# EAGLE schematic slaveV11 (EAGLE 6.3)

## Sheet 1 of 2
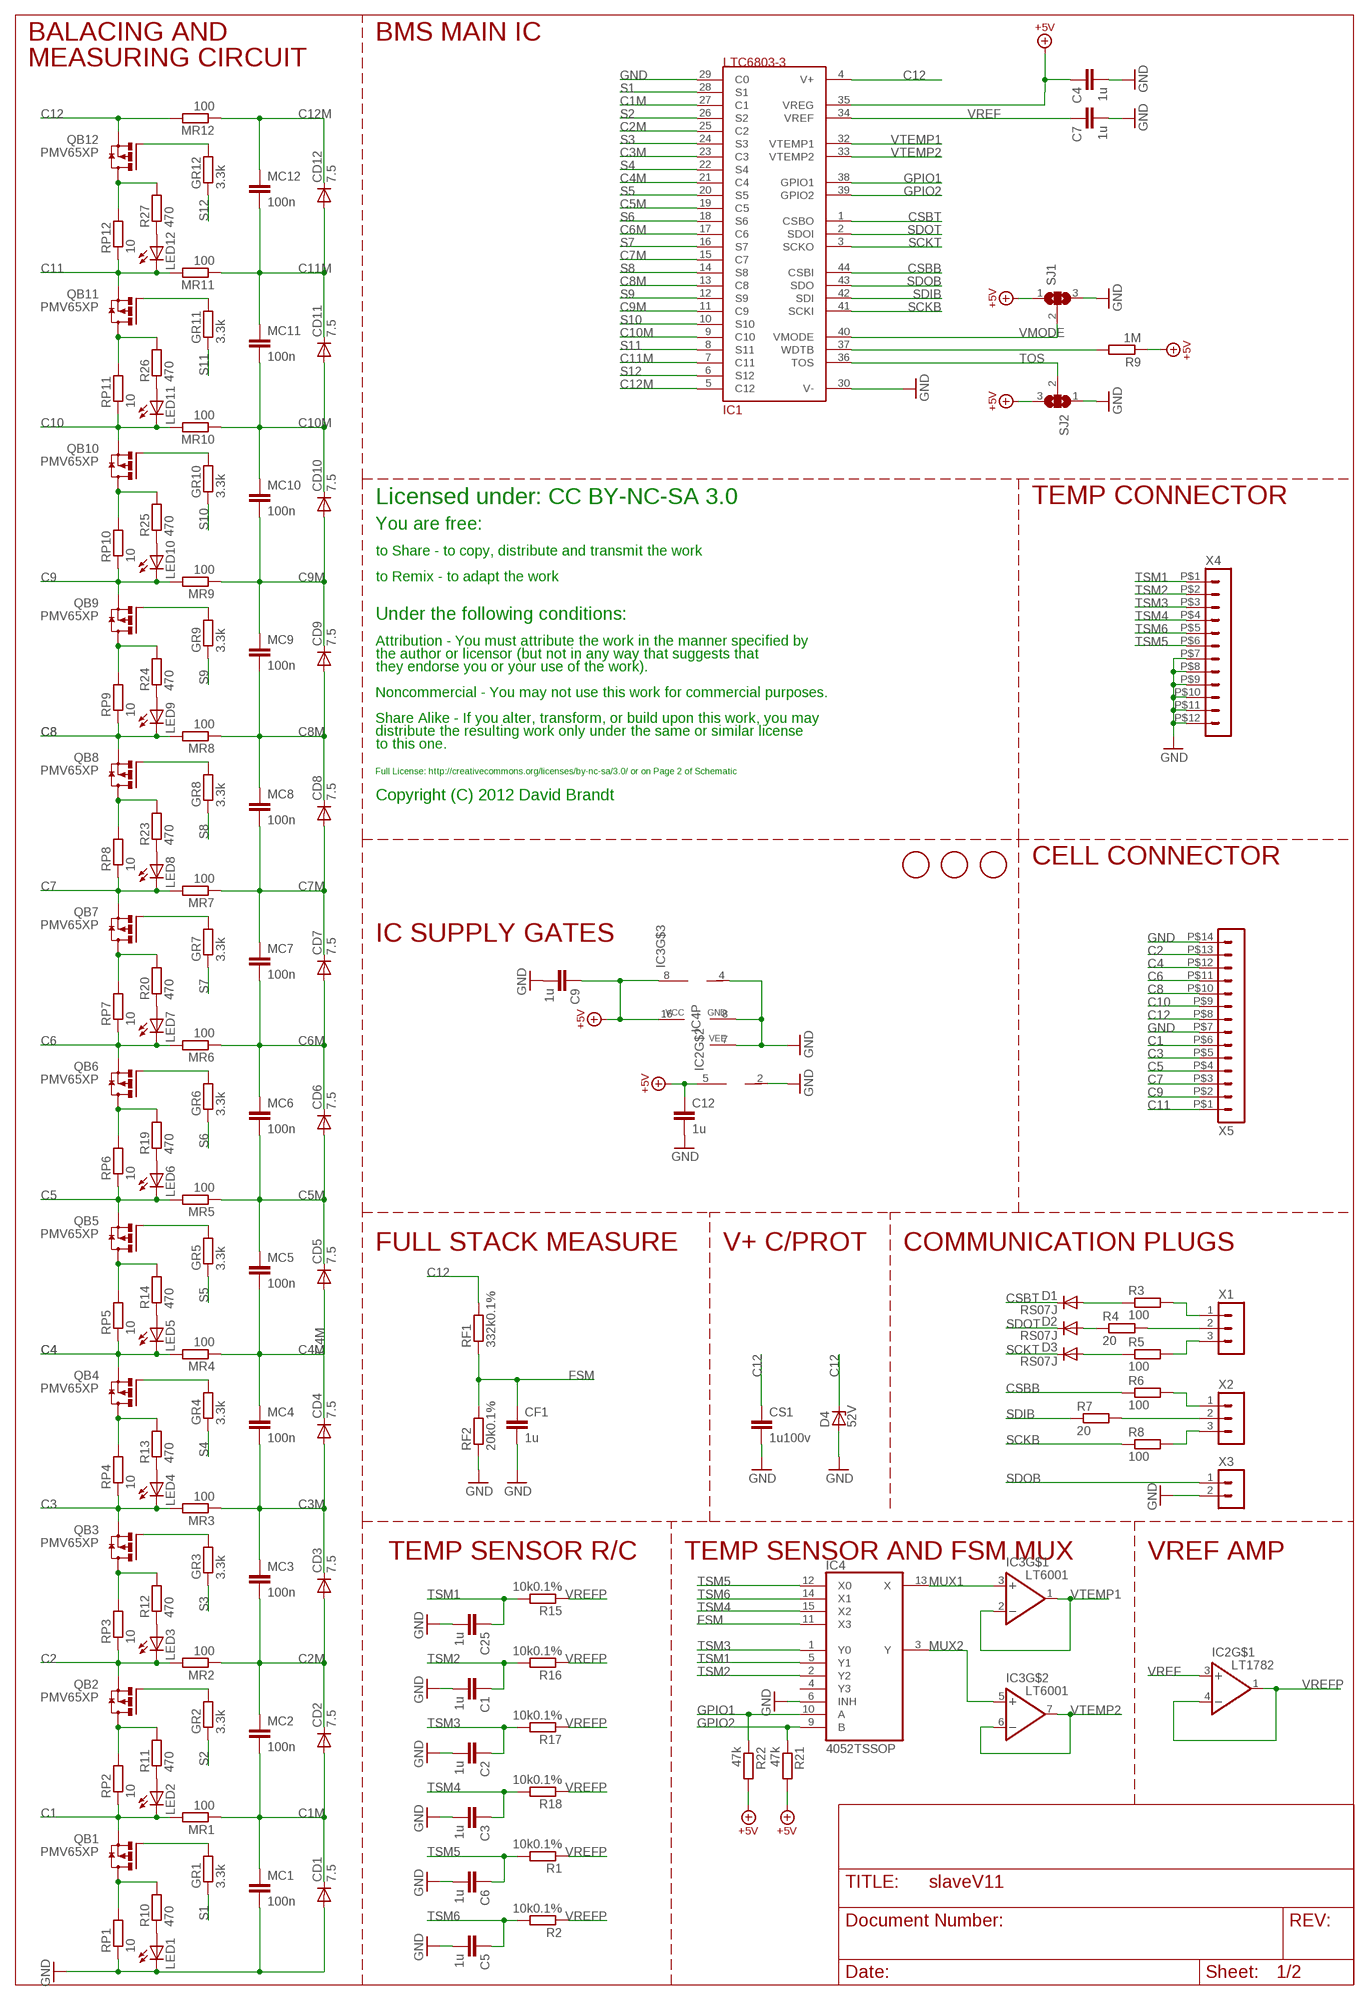
[diagram p0: schematic, sheet 1]

### Parts
C1  1u  C-EUC0603  [C0603]
C2  1u  C-EUC0603  [C0603]
C3  1u  C-EUC0603  [C0603]
C4  1u  C-EUC0603  [C0603]
C5  1u  C-EUC0603  [C0603]
C6  1u  C-EUC0603  [C0603]
C7  1u  C-EUC0603  [C0603]
C9  1u  C-EUC0603  [C0603]
C12  1u  C-EUC0603  [C0603]
C25  1u  C-EUC0603  [C0603]
CD1  7.5  DIODE-SOD323-W  [SOD323-W]
CD2  7.5  DIODE-SOD323-W  [SOD323-W]
CD3  7.5  DIODE-SOD323-W  [SOD323-W]
CD4  7.5  DIODE-SOD323-W  [SOD323-W]
CD5  7.5  DIODE-SOD323-W  [SOD323-W]
CD6  7.5  DIODE-SOD323-W  [SOD323-W]
CD7  7.5  DIODE-SOD323-W  [SOD323-W]
CD8  7.5  DIODE-SOD323-W  [SOD323-W]
CD9  7.5  DIODE-SOD323-W  [SOD323-W]
CD10  7.5  DIODE-SOD323-W  [SOD323-W]
CD11  7.5  DIODE-SOD323-W  [SOD323-W]
CD12  7.5  DIODE-SOD323-W  [SOD323-W]
CF1  1u  C-EUC0603  [C0603]
CS1  1u100v  C-EUC1206K  [C1206K]
D1  RS07J  [DO-219AB]
D2  RS07J  [DO-219AB]
D3  RS07J  [DO-219AB]
D4  52V  ZENER-DIODESOD123  [SOD123]
GR1  3.3k  R-EU_R0603  [R0603]
GR2  3.3k  R-EU_R0603  [R0603]
GR3  3.3k  R-EU_R0603  [R0603]
GR4  3.3k  R-EU_R0603  [R0603]
GR5  3.3k  R-EU_R0603  [R0603]
GR6  3.3k  R-EU_R0603  [R0603]
GR7  3.3k  R-EU_R0603  [R0603]
GR8  3.3k  R-EU_R0603  [R0603]
GR9  3.3k  R-EU_R0603  [R0603]
GR10  3.3k  R-EU_R0603  [R0603]
GR11  3.3k  R-EU_R0603  [R0603]
GR12  3.3k  R-EU_R0603  [R0603]
IC1  LTC6803-3  [44SSOP]
IC2  LT1782  [SOT23-5]
IC3  LT6001  LT6004  [MS8]
IC4  4052TSSOP  [TSSOP16]
LED1  LEDCHIPLED_0805  [CHIPLED_0805]
LED2  LEDCHIPLED_0805  [CHIPLED_0805]
LED3  LEDCHIPLED_0805  [CHIPLED_0805]
LED4  LEDCHIPLED_0805  [CHIPLED_0805]
LED5  LEDCHIPLED_0805  [CHIPLED_0805]
LED6  LEDCHIPLED_0805  [CHIPLED_0805]
LED7  LEDCHIPLED_0805  [CHIPLED_0805]
LED8  LEDCHIPLED_0805  [CHIPLED_0805]
LED9  LEDCHIPLED_0805  [CHIPLED_0805]
LED10  LEDCHIPLED_0805  [CHIPLED_0805]
LED11  LEDCHIPLED_0805  [CHIPLED_0805]
LED12  LEDCHIPLED_0805  [CHIPLED_0805]
MC1  100n  C-EUC1206  [C1206]
MC2  100n  C-EUC1206  [C1206]
MC3  100n  C-EUC1206  [C1206]
MC4  100n  C-EUC1206  [C1206]
MC5  100n  C-EUC1206  [C1206]
MC6  100n  C-EUC1206  [C1206]
MC7  100n  C-EUC1206  [C1206]
MC8  100n  C-EUC1206  [C1206]
MC9  100n  C-EUC1206  [C1206]
MC10  100n  C-EUC1206  [C1206]
MC11  100n  C-EUC1206  [C1206]
MC12  100n  C-EUC1206  [C1206]
MR1  100  R-EU_R0603  [R0603]
MR2  100  R-EU_R0603  [R0603]
MR3  100  R-EU_R0603  [R0603]
MR4  100  R-EU_R0603  [R0603]
MR5  100  R-EU_R0603  [R0603]
MR6  100  R-EU_R0603  [R0603]
MR7  100  R-EU_R0603  [R0603]
MR8  100  R-EU_R0603  [R0603]
MR9  100  R-EU_R0603  [R0603]
MR10  100  R-EU_R0603  [R0603]
MR11  100  R-EU_R0603  [R0603]
MR12  100  R-EU_R0603  [R0603]
QB1  PMV65XP  FDN360P  [SUPER-SOT3]
QB2  PMV65XP  FDN360P  [SUPER-SOT3]
QB3  PMV65XP  FDN360P  [SUPER-SOT3]
QB4  PMV65XP  FDN360P  [SUPER-SOT3]
QB5  PMV65XP  FDN360P  [SUPER-SOT3]
QB6  PMV65XP  FDN360P  [SUPER-SOT3]
QB7  PMV65XP  FDN360P  [SUPER-SOT3]
QB8  PMV65XP  FDN360P  [SUPER-SOT3]
QB9  PMV65XP  FDN360P  [SUPER-SOT3]
QB10  PMV65XP  FDN360P  [SUPER-SOT3]
QB11  PMV65XP  FDN360P  [SUPER-SOT3]
QB12  PMV65XP  FDN360P  [SUPER-SOT3]
R1  10k0.1%  R-EU_R0603  [R0603]
R2  10k0.1%  R-EU_R0603  [R0603]
R3  100  R-EU_R0805  [R0805]
R4  20  R-EU_R0805  [R0805]
R5  100  R-EU_R0805  [R0805]
R6  100  R-EU_R0805  [R0805]
R7  20  R-EU_R0805  [R0805]
R8  100  R-EU_R0805  [R0805]
R9  1M  R-EU_R0603  [R0603]
R10  470  R-EU_R0603  [R0603]
R11  470  R-EU_R0603  [R0603]
R12  470  R-EU_R0603  [R0603]
R13  470  R-EU_R0603  [R0603]
R14  470  R-EU_R0603  [R0603]
R15  10k0.1%  R-EU_R0603  [R0603]
R16  10k0.1%  R-EU_R0603  [R0603]
R17  10k0.1%  R-EU_R0603  [R0603]
R18  10k0.1%  R-EU_R0603  [R0603]
R19  470  R-EU_R0603  [R0603]
R20  470  R-EU_R0603  [R0603]
R21  47k  R-EU_R0603  [R0603]
R22  47k  R-EU_R0603  [R0603]
R23  470  R-EU_R0603  [R0603]
R24  470  R-EU_R0603  [R0603]
R25  470  R-EU_R0603  [R0603]
R26  470  R-EU_R0603  [R0603]
R27  470  R-EU_R0603  [R0603]
REF1  FIDUCIALMOUNT  [FIDUCIA-MOUNT]
REF2  FIDUCIALMOUNT  [FIDUCIA-MOUNT]
REF3  FIDUCIALMOUNT  [FIDUCIA-MOUNT]
RF1  332k0.1%  R-EU_R0603  [R0603]
RF2  20k0.1%  R-EU_R0603  [R0603]
RP1  10  R-EU_SM_3  [SM_3]
RP2  10  R-EU_SM_3  [SM_3]
RP3  10  R-EU_SM_3  [SM_3]
RP4  10  R-EU_SM_3  [SM_3]
RP5  10  R-EU_SM_3  [SM_3]
RP6  10  R-EU_SM_3  [SM_3]
RP7  10  R-EU_SM_3  [SM_3]
RP8  10  R-EU_SM_3  [SM_3]
RP9  10  R-EU_SM_3  [SM_3]
RP10  10  R-EU_SM_3  [SM_3]
RP11  10  R-EU_SM_3  [SM_3]
RP12  10  R-EU_SM_3  [SM_3]
SJ1  SJ2W  [SJ_2]
SJ2  SJ2W  [SJ_2]
X1  HEADER_POS3_43650-0315  [43650-0315]
X2  HEADER_POS3_43650-0315  [43650-0315]
X3  HEADER_POS2_43650-0215  [43650-0215]
X4  HEADER_POS12_43045-1212  [43045-1212]
X5  HEADER_POS14_43045-1412  [43045-1412]

### Nets
+5V: C4.1 C9.1 C12.1 IC1.35(VREG) IC2.5(V+) IC3.8(V+) IC4.16(VCC) R9.1 R21.2 R22.2 SJ1.1 SJ2.3 ; supply symbol labelled V+5V
B1: QB1.3(D) R10.2 RP1.P$2
B2: QB2.3(D) R11.2 RP2.P$2
B3: QB3.3(D) R12.2 RP3.P$2
B4: QB4.3(D) R13.2 RP4.P$2
B5: QB5.3(D) R14.2 RP5.P$2
B6: QB6.3(D) R19.2 RP6.P$2
B7: QB7.3(D) R20.2 RP7.P$2
B8: QB8.3(D) R23.2 RP8.P$2
B9: QB9.3(D) R24.2 RP9.P$2
B10: QB10.3(D) R25.2 RP10.P$2
B11: QB11.3(D) R26.2 RP11.P$2
B12: QB12.3(D) R27.2 RP12.P$2
C1: LED2.C MR1.2 QB1.2(S) RP2.P$1 X5.P$6
C1M: CD1.C CD2.A IC1.27(C1) MC1.1 MC2.2 MR1.1
C2: LED3.C MR2.2 QB2.2(S) RP3.P$1 X5.P$13
C2M: CD2.C CD3.A IC1.25(C2) MC2.1 MC3.2 MR2.1
C3: LED4.C MR3.2 QB3.2(S) RP4.P$1 X5.P$5
C3M: CD3.C CD4.A IC1.23(C3) MC3.1 MC4.2 MR3.1
C4: LED5.C MR4.2 QB4.2(S) RP5.P$1 X5.P$12
C4M: CD4.C CD5.A IC1.21(C4) MC4.1 MC5.2 MR4.1
C5: LED6.C MR5.2 QB5.2(S) RP6.P$1 X5.P$4
C5M: CD5.C CD6.A IC1.19(C5) MC5.1 MC6.2 MR5.1
C6: LED7.C MR6.2 QB6.2(S) RP7.P$1 X5.P$11
C6M: CD6.C CD7.A IC1.17(C6) MC6.1 MC7.2 MR6.1
C7: LED8.C MR7.2 QB7.2(S) RP8.P$1 X5.P$3
C7M: CD7.C CD8.A IC1.15(C7) MC7.1 MC8.2 MR7.1
C8: LED9.C MR8.2 QB8.2(S) RP9.P$1 X5.P$10
C8M: CD8.C CD9.A IC1.13(C8) MC8.1 MC9.2 MR8.1
C9: LED10.C MR9.2 QB9.2(S) RP10.P$1 X5.P$2
C9M: CD9.C CD10.A IC1.11(C9) MC9.1 MC10.2 MR9.1
C10: LED11.C MR10.2 QB10.2(S) RP11.P$1 X5.P$9
C10M: CD10.C CD11.A IC1.9(C10) MC10.1 MC11.2 MR10.1
C11: LED12.C MR11.2 QB11.2(S) RP12.P$1 X5.P$1
C11M: CD11.C CD12.A IC1.7(C11) MC11.1 MC12.2 MR11.1
C12: CS1.1 D4.C IC1.4(V+) MR12.2 QB12.2(S) RF1.2 X5.P$8
C12M: CD12.C IC1.5(C12) MC12.1 MR12.1
CSBB: IC1.44(CSBI) R6.1
CSBBP: R6.2 X2.1
CSBT: D1.C IC1.1(CSBO)
CSBTK: D1.A R3.1
CSBTP: R3.2 X1.1
FSM: CF1.1 IC4.11(X3) RF1.1 RF2.2
GND: C1.2 C2.2 C3.2 C4.2 C5.2 C6.2 C7.2 C9.2 C12.2 C25.2 CD1.A CF1.2 CS1.2 D4.A IC1.29(C0) IC1.30(V-) IC2.2(V-) IC3.4(V-) IC4.6(INH) IC4.7(VEE) IC4.8(GND) LED1.C MC1.2 RF2.1 RP1.P$1 SJ1.3 SJ2.1 X3.2 X4.P$7 X4.P$8 X4.P$9 X4.P$10 X4.P$11 X4.P$12 X5.P$7 X5.P$14
GPIO1: IC1.38(GPIO1) IC4.10(A) R22.1
GPIO2: IC1.39(GPIO2) IC4.9(B) R21.1
L1C: LED1.A R10.1
L2C: LED2.A R11.1
L3C: LED3.A R12.1
L4C: LED4.A R13.1
L5C: LED5.A R14.1
L6C: LED6.A R19.1
L7C: LED7.A R20.1
L8C: LED8.A R23.1
L9C: LED9.A R24.1
L10C: LED10.A R25.1
L11C: LED11.A R26.1
L12C: LED12.A R27.1
MUX1: IC3.3(+IN) IC4.13(X)
MUX2: IC3.5(+IN) IC4.3(Y)
S1: GR1.1 IC1.28(S1)
S1G: GR1.2 QB1.1(G)
S1G1: GR2.2 QB2.1(G)
S1G2: GR3.2 QB3.1(G)
S1G3: GR4.2 QB4.1(G)
S1G4: GR5.2 QB5.1(G)
S1G5: GR6.2 QB6.1(G)
S1G6: GR7.2 QB7.1(G)
S1G7: GR8.2 QB8.1(G)
S1G8: GR9.2 QB9.1(G)
S1G9: GR10.2 QB10.1(G)
S1G10: GR11.2 QB11.1(G)
S1G11: GR12.2 QB12.1(G)
S2: GR2.1 IC1.26(S2)
S3: GR3.1 IC1.24(S3)
S4: GR4.1 IC1.22(S4)
S5: GR5.1 IC1.20(S5)
S6: GR6.1 IC1.18(S6)
S7: GR7.1 IC1.16(S7)
S8: GR8.1 IC1.14(S8)
S9: GR9.1 IC1.12(S9)
S10: GR10.1 IC1.10(S10)
S11: GR11.1 IC1.8(S11)
S12: GR12.1 IC1.6(S12)
SCKB: IC1.41(SCKI) R8.1
SCKBP: R8.2 X2.3
SCKT: D3.C IC1.3(SCKO)
SCKTK: D3.A R5.1
SCKTP: R5.2 X1.3
SDIB: IC1.42(SDI) R7.1
SDIBP: R7.2 X2.2
SDOB: IC1.43(SDO) X3.1
SDOT: D2.C IC1.2(SDOI)
SDOTK: D2.A R4.1
SDOTP: R4.2 X1.2
TOS: IC1.36(TOS) SJ2.2
TSM1: C25.1 IC4.5(Y1) R15.2 X4.P$1
TSM2: C1.1 IC4.2(Y2) R16.2 X4.P$2
TSM3: C2.1 IC4.1(Y0) R17.2 X4.P$3
TSM4: C3.1 IC4.15(X2) R18.2 X4.P$4
TSM5: C6.1 IC4.12(X0) R1.2 X4.P$6
TSM6: C5.1 IC4.14(X1) R2.2 X4.P$5
VMODE: IC1.40(VMODE) SJ1.2
VREF: C7.1 IC1.34(VREF) IC2.3(+IN)
VREFP: IC2.1(OUT) IC2.4(-IN) R1.1 R2.1 R15.1 R16.1 R17.1 R18.1
VTEMP1: IC1.32(VTEMP1) IC3.1(OUT) IC3.2(-IN)
VTEMP2: IC1.33(VTEMP2) IC3.6(-IN) IC3.7(OUT)
WDTB: IC1.37(WDTB) R9.2
Unconnected: IC4.4(Y3)

### Notes on the sheet
- BALACING AND | BMS MAIN IC
- MEASURING CIRCUIT
- Licensed under: CC BY-NC-SA 3.0 | TEMP CONNECTOR
- You are free:
- to Share - to copy, distribute and transmit the work
- to Remix - to adapt the work
- Under the following conditions:
- Attribution - You must attribute the work in the manner specified by
- the author or licensor (but not in any way that suggests that
- they endorse you or your use of the work).
- Noncommercial - You may not use this work for commercial purposes.
- Share Alike - If you alter, transform, or build upon this work, you may
- distribute the resulting work only under the same or similar license
- to this one.
- Full License: http://creativecommons.org/licenses/by-nc-sa/3.0/ or on Page 2 of Schematic
- Copyright (C) 2012 David Brandt
- CELL CONNECTOR
- IC SUPPLY GATES
- FULL STACK MEASURE | V+ C/PROT | COMMUNICATION PLUGS
- TEMP SENSOR R/C | TEMP SENSOR AND FSM MUX | VREF AMP

## Sheet 2 of 2
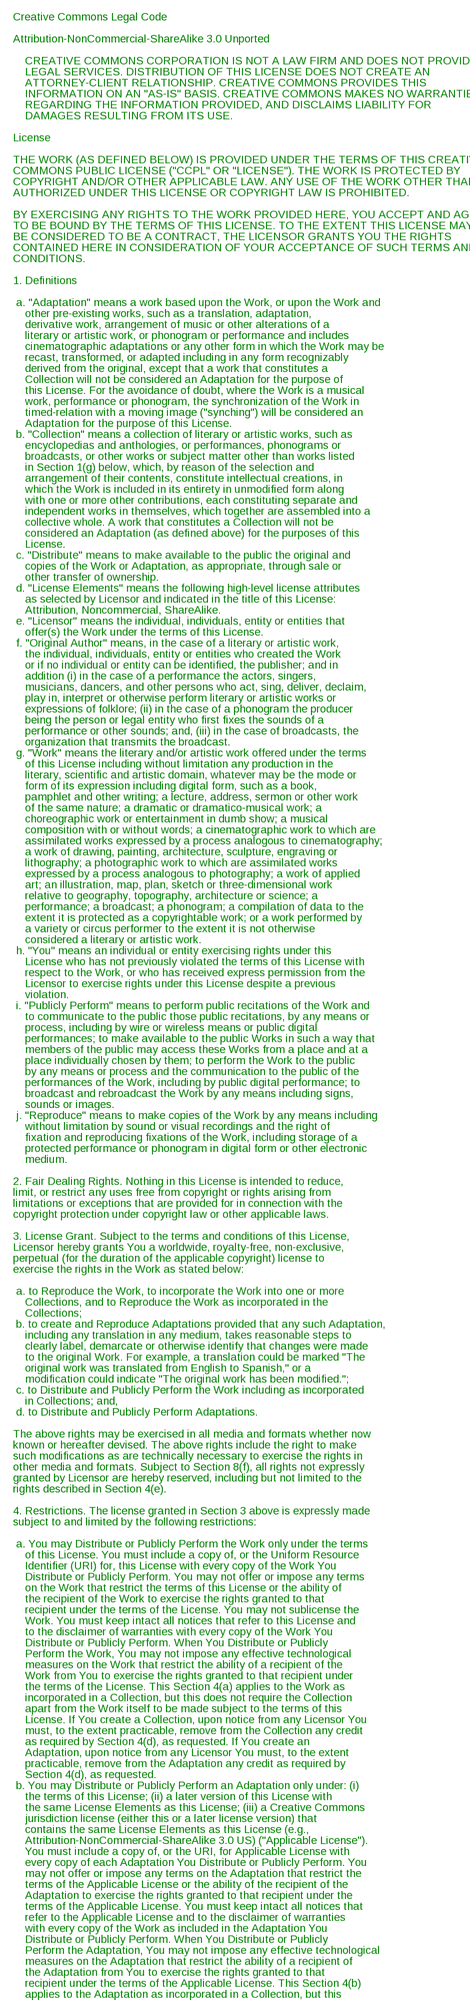
[diagram p1: schematic, sheet 2, part 1 of 2]
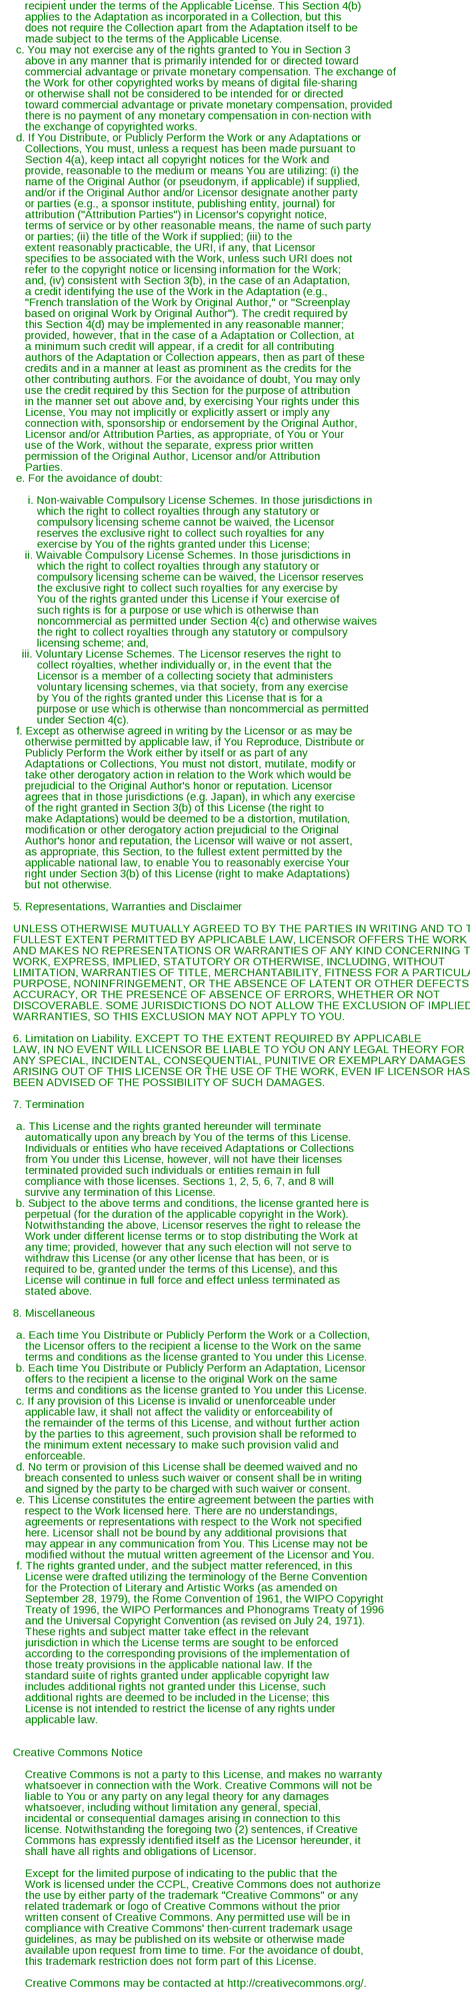
[diagram p2: schematic, sheet 2, part 2 of 2]

### Notes on the sheet
- Creative Commons Legal Code
- Attribution-NonCommercial-ShareAlike 3.0 Unported
- CREATIVE COMMONS CORPORATION IS NOT A LAW FIRM AND DOES NOT PROVIDE
- LEGAL SERVICES. DISTRIBUTION OF THIS LICENSE DOES NOT CREATE AN
- ATTORNEY-CLIENT RELATIONSHIP. CREATIVE COMMONS PROVIDES THIS
- INFORMATION ON AN "AS-IS" BASIS. CREATIVE COMMONS MAKES NO WARRANTIES
- REGARDING THE INFORMATION PROVIDED, AND DISCLAIMS LIABILITY FOR
- DAMAGES RESULTING FROM ITS USE.
- License
- THE WORK (AS DEFINED BELOW) IS PROVIDED UNDER THE TERMS OF THIS CREATIVE
- COMMONS PUBLIC LICENSE ("CCPL" OR "LICENSE"). THE WORK IS PROTECTED BY
- COPYRIGHT AND/OR OTHER APPLICABLE LAW. ANY USE OF THE WORK OTHER THAN AS
- AUTHORIZED UNDER THIS LICENSE OR COPYRIGHT LAW IS PROHIBITED.
- BY EXERCISING ANY RIGHTS TO THE WORK PROVIDED HERE, YOU ACCEPT AND AGREE
- TO BE BOUND BY THE TERMS OF THIS LICENSE. TO THE EXTENT THIS LICENSE MAY
- BE CONSIDERED TO BE A CONTRACT, THE LICENSOR GRANTS YOU THE RIGHTS
- CONTAINED HERE IN CONSIDERATION OF YOUR ACCEPTANCE OF SUCH TERMS AND
- CONDITIONS.
- 1. Definitions
- a. "Adaptation" means a work based upon the Work, or upon the Work and
- other pre-existing works, such as a translation, adaptation,
- derivative work, arrangement of music or other alterations of a
- literary or artistic work, or phonogram or performance and includes
- cinematographic adaptations or any other form in which the Work may be
- recast, transformed, or adapted including in any form recognizably
- derived from the original, except that a work that constitutes a
- Collection will not be considered an Adaptation for the purpose of
- this License. For the avoidance of doubt, where the Work is a musical
- work, performance or phonogram, the synchronization of the Work in
- timed-relation with a moving image ("synching") will be considered an
- Adaptation for the purpose of this License.
- b. "Collection" means a collection of literary or artistic works, such as
- encyclopedias and anthologies, or performances, phonograms or
- broadcasts, or other works or subject matter other than works listed
- in Section 1(g) below, which, by reason of the selection and
- arrangement of their contents, constitute intellectual creations, in
- which the Work is included in its entirety in unmodified form along
- with one or more other contributions, each constituting separate and
- independent works in themselves, which together are assembled into a
- collective whole. A work that constitutes a Collection will not be
- considered an Adaptation (as defined above) for the purposes of this
- License.
- c. "Distribute" means to make available to the public the original and
- copies of the Work or Adaptation, as appropriate, through sale or
- other transfer of ownership.
- d. "License Elements" means the following high-level license attributes
- as selected by Licensor and indicated in the title of this License:
- Attribution, Noncommercial, ShareAlike.
- e. "Licensor" means the individual, individuals, entity or entities that
- offer(s) the Work under the terms of this License.
- f. "Original Author" means, in the case of a literary or artistic work,
- the individual, individuals, entity or entities who created the Work
- or if no individual or entity can be identified, the publisher; and in
- addition (i) in the case of a performance the actors, singers,
- musicians, dancers, and other persons who act, sing, deliver, declaim,
- play in, interpret or otherwise perform literary or artistic works or
- expressions of folklore; (ii) in the case of a phonogram the producer
- being the person or legal entity who first fixes the sounds of a
- performance or other sounds; and, (iii) in the case of broadcasts, the
- organization that transmits the broadcast.
- g. "Work" means the literary and/or artistic work offered under the terms
- of this License including without limitation any production in the
- literary, scientific and artistic domain, whatever may be the mode or
- form of its expression including digital form, such as a book,
- pamphlet and other writing; a lecture, address, sermon or other work
- of the same nature; a dramatic or dramatico-musical work; a
- choreographic work or entertainment in dumb show; a musical
- composition with or without words; a cinematographic work to which are
- assimilated works expressed by a process analogous to cinematography;
- a work of drawing, painting, architecture, sculpture, engraving or
- lithography; a photographic work to which are assimilated works
- expressed by a process analogous to photography; a work of applied
- art; an illustration, map, plan, sketch or three-dimensional work
- relative to geography, topography, architecture or science; a
- performance; a broadcast; a phonogram; a compilation of data to the
- extent it is protected as a copyrightable work; or a work performed by
- a variety or circus performer to the extent it is not otherwise
- considered a literary or artistic work.
- h. "You" means an individual or entity exercising rights under this
- License who has not previously violated the terms of this License with
- respect to the Work, or who has received express permission from the
- Licensor to exercise rights under this License despite a previous
- violation.
- i. "Publicly Perform" means to perform public recitations of the Work and
- to communicate to the public those public recitations, by any means or
- process, including by wire or wireless means or public digital
- performances; to make available to the public Works in such a way that
- members of the public may access these Works from a place and at a
- place individually chosen by them; to perform the Work to the public
- by any means or process and the communication to the public of the
- performances of the Work, including by public digital performance; to
- broadcast and rebroadcast the Work by any means including signs,
- sounds or images.
- j. "Reproduce" means to make copies of the Work by any means including
- without limitation by sound or visual recordings and the right of
- fixation and reproducing fixations of the Work, including storage of a
- protected performance or phonogram in digital form or other electronic
- medium.
- 2. Fair Dealing Rights. Nothing in this License is intended to reduce,
- limit, or restrict any uses free from copyright or rights arising from
- limitations or exceptions that are provided for in connection with the
- copyright protection under copyright law or other applicable laws.
- 3. License Grant. Subject to the terms and conditions of this License,
- Licensor hereby grants You a worldwide, royalty-free, non-exclusive,
- perpetual (for the duration of the applicable copyright) license to
- exercise the rights in the Work as stated below:
- a. to Reproduce the Work, to incorporate the Work into one or more
- Collections, and to Reproduce the Work as incorporated in the
- Collections;
- b. to create and Reproduce Adaptations provided that any such Adaptation,
- including any translation in any medium, takes reasonable steps to
- clearly label, demarcate or otherwise identify that changes were made
- to the original Work. For example, a translation could be marked "The
- original work was translated from English to Spanish," or a
- modification could indicate "The original work has been modified.";
- c. to Distribute and Publicly Perform the Work including as incorporated
- in Collections; and,
- d. to Distribute and Publicly Perform Adaptations.
- The above rights may be exercised in all media and formats whether now
- known or hereafter devised. The above rights include the right to make
- such modifications as are technically necessary to exercise the rights in
- other media and formats. Subject to Section 8(f), all rights not expressly
- granted by Licensor are hereby reserved, including but not limited to the
- rights described in Section 4(e).
- 4. Restrictions. The license granted in Section 3 above is expressly made
- subject to and limited by the following restrictions:
- a. You may Distribute or Publicly Perform the Work only under the terms
- of this License. You must include a copy of, or the Uniform Resource
- Identifier (URI) for, this License with every copy of the Work You
- Distribute or Publicly Perform. You may not offer or impose any terms
- on the Work that restrict the terms of this License or the ability of
- the recipient of the Work to exercise the rights granted to that
- recipient under the terms of the License. You may not sublicense the
- Work. You must keep intact all notices that refer to this License and
- to the disclaimer of warranties with every copy of the Work You
- Distribute or Publicly Perform. When You Distribute or Publicly
- Perform the Work, You may not impose any effective technological
- measures on the Work that restrict the ability of a recipient of the
- Work from You to exercise the rights granted to that recipient under
- the terms of the License. This Section 4(a) applies to the Work as
- incorporated in a Collection, but this does not require the Collection
- apart from the Work itself to be made subject to the terms of this
- License. If You create a Collection, upon notice from any Licensor You
- must, to the extent practicable, remove from the Collection any credit
- as required by Section 4(d), as requested. If You create an
- Adaptation, upon notice from any Licensor You must, to the extent
- practicable, remove from the Adaptation any credit as required by
- Section 4(d), as requested.
- b. You may Distribute or Publicly Perform an Adaptation only under: (i)
- the terms of this License; (ii) a later version of this License with
- the same License Elements as this License; (iii) a Creative Commons
- jurisdiction license (either this or a later license version) that
- contains the same License Elements as this License (e.g.,
- Attribution-NonCommercial-ShareAlike 3.0 US) ("Applicable License").
- You must include a copy of, or the URI, for Applicable License with
- every copy of each Adaptation You Distribute or Publicly Perform. You
- may not offer or impose any terms on the Adaptation that restrict the
- terms of the Applicable License or the ability of the recipient of the
- Adaptation to exercise the rights granted to that recipient under the
- terms of the Applicable License. You must keep intact all notices that
- refer to the Applicable License and to the disclaimer of warranties
- with every copy of the Work as included in the Adaptation You
- Distribute or Publicly Perform. When You Distribute or Publicly
- Perform the Adaptation, You may not impose any effective technological
- measures on the Adaptation that restrict the ability of a recipient of
- the Adaptation from You to exercise the rights granted to that
- recipient under the terms of the Applicable License. This Section 4(b)
- applies to the Adaptation as incorporated in a Collection, but this
- does not require the Collection apart from the Adaptation itself to be
- made subject to the terms of the Applicable License.
- c. You may not exercise any of the rights granted to You in Section 3
- above in any manner that is primarily intended for or directed toward
- commercial advantage or private monetary compensation. The exchange of
- the Work for other copyrighted works by means of digital file-sharing
- or otherwise shall not be considered to be intended for or directed
- toward commercial advantage or private monetary compensation, provided
- there is no payment of any monetary compensation in con-nection with
- the exchange of copyrighted works.
- d. If You Distribute, or Publicly Perform the Work or any Adaptations or
- Collections, You must, unless a request has been made pursuant to
- Section 4(a), keep intact all copyright notices for the Work and
- provide, reasonable to the medium or means You are utilizing: (i) the
- name of the Original Author (or pseudonym, if applicable) if supplied,
- and/or if the Original Author and/or Licensor designate another party
- or parties (e.g., a sponsor institute, publishing entity, journal) for
- attribution ("Attribution Parties") in Licensor's copyright notice,
- terms of service or by other reasonable means, the name of such party
- or parties; (ii) the title of the Work if supplied; (iii) to the
- extent reasonably practicable, the URI, if any, that Licensor
- specifies to be associated with the Work, unless such URI does not
- refer to the copyright notice or licensing information for the Work;
- and, (iv) consistent with Section 3(b), in the case of an Adaptation,
- a credit identifying the use of the Work in the Adaptation (e.g.,
- "French translation of the Work by Original Author," or "Screenplay
- based on original Work by Original Author"). The credit required by
- this Section 4(d) may be implemented in any reasonable manner;
- provided, however, that in the case of a Adaptation or Collection, at
- a minimum such credit will appear, if a credit for all contributing
- authors of the Adaptation or Collection appears, then as part of these
- credits and in a manner at least as prominent as the credits for the
- other contributing authors. For the avoidance of doubt, You may only
- use the credit required by this Section for the purpose of attribution
- in the manner set out above and, by exercising Your rights under this
- License, You may not implicitly or explicitly assert or imply any
- connection with, sponsorship or endorsement by the Original Author,
- Licensor and/or Attribution Parties, as appropriate, of You or Your
- use of the Work, without the separate, express prior written
- permission of the Original Author, Licensor and/or Attribution
- Parties.
- e. For the avoidance of doubt:
- i. Non-waivable Compulsory License Schemes. In those jurisdictions in
- which the right to collect royalties through any statutory or
- compulsory licensing scheme cannot be waived, the Licensor
- reserves the exclusive right to collect such royalties for any
- exercise by You of the rights granted under this License;
- ii. Waivable Compulsory License Schemes. In those jurisdictions in
- which the right to collect royalties through any statutory or
- compulsory licensing scheme can be waived, the Licensor reserves
- the exclusive right to collect such royalties for any exercise by
- You of the rights granted under this License if Your exercise of
- such rights is for a purpose or use which is otherwise than
- noncommercial as permitted under Section 4(c) and otherwise waives
- the right to collect royalties through any statutory or compulsory
- licensing scheme; and,
- iii. Voluntary License Schemes. The Licensor reserves the right to
- collect royalties, whether individually or, in the event that the
- Licensor is a member of a collecting society that administers
- voluntary licensing schemes, via that society, from any exercise
- by You of the rights granted under this License that is for a
- purpose or use which is otherwise than noncommercial as permitted
- under Section 4(c).
- f. Except as otherwise agreed in writing by the Licensor or as may be
- otherwise permitted by applicable law, if You Reproduce, Distribute or
- Publicly Perform the Work either by itself or as part of any
- Adaptations or Collections, You must not distort, mutilate, modify or
- take other derogatory action in relation to the Work which would be
- prejudicial to the Original Author's honor or reputation. Licensor
- agrees that in those jurisdictions (e.g. Japan), in which any exercise
- of the right granted in Section 3(b) of this License (the right to
- make Adaptations) would be deemed to be a distortion, mutilation,
- modification or other derogatory action prejudicial to the Original
- Author's honor and reputation, the Licensor will waive or not assert,
- as appropriate, this Section, to the fullest extent permitted by the
- applicable national law, to enable You to reasonably exercise Your
- right under Section 3(b) of this License (right to make Adaptations)
- but not otherwise.
- 5. Representations, Warranties and Disclaimer
- UNLESS OTHERWISE MUTUALLY AGREED TO BY THE PARTIES IN WRITING AND TO THE
- FULLEST EXTENT PERMITTED BY APPLICABLE LAW, LICENSOR OFFERS THE WORK AS-IS
- AND MAKES NO REPRESENTATIONS OR WARRANTIES OF ANY KIND CONCERNING THE
- WORK, EXPRESS, IMPLIED, STATUTORY OR OTHERWISE, INCLUDING, WITHOUT
- LIMITATION, WARRANTIES OF TITLE, MERCHANTABILITY, FITNESS FOR A PARTICULAR
- PURPOSE, NONINFRINGEMENT, OR THE ABSENCE OF LATENT OR OTHER DEFECTS,
- ACCURACY, OR THE PRESENCE OF ABSENCE OF ERRORS, WHETHER OR NOT
- DISCOVERABLE. SOME JURISDICTIONS DO NOT ALLOW THE EXCLUSION OF IMPLIED
- WARRANTIES, SO THIS EXCLUSION MAY NOT APPLY TO YOU.
- 6. Limitation on Liability. EXCEPT TO THE EXTENT REQUIRED BY APPLICABLE
- LAW, IN NO EVENT WILL LICENSOR BE LIABLE TO YOU ON ANY LEGAL THEORY FOR
- ANY SPECIAL, INCIDENTAL, CONSEQUENTIAL, PUNITIVE OR EXEMPLARY DAMAGES
- ARISING OUT OF THIS LICENSE OR THE USE OF THE WORK, EVEN IF LICENSOR HAS
- BEEN ADVISED OF THE POSSIBILITY OF SUCH DAMAGES.
- 7. Termination
- a. This License and the rights granted hereunder will terminate
- automatically upon any breach by You of the terms of this License.
- Individuals or entities who have received Adaptations or Collections
- from You under this License, however, will not have their licenses
- terminated provided such individuals or entities remain in full
- compliance with those licenses. Sections 1, 2, 5, 6, 7, and 8 will
- survive any termination of this License.
- b. Subject to the above terms and conditions, the license granted here is
- perpetual (for the duration of the applicable copyright in the Work).
- Notwithstanding the above, Licensor reserves the right to release the
- Work under different license terms or to stop distributing the Work at
- any time; provided, however that any such election will not serve to
- withdraw this License (or any other license that has been, or is
- required to be, granted under the terms of this License), and this
- License will continue in full force and effect unless terminated as
- stated above.
- 8. Miscellaneous
- a. Each time You Distribute or Publicly Perform the Work or a Collection,
- the Licensor offers to the recipient a license to the Work on the same
- terms and conditions as the license granted to You under this License.
- b. Each time You Distribute or Publicly Perform an Adaptation, Licensor
- offers to the recipient a license to the original Work on the same
- terms and conditions as the license granted to You under this License.
- c. If any provision of this License is invalid or unenforceable under
- applicable law, it shall not affect the validity or enforceability of
- the remainder of the terms of this License, and without further action
- by the parties to this agreement, such provision shall be reformed to
- the minimum extent necessary to make such provision valid and
- enforceable.
- d. No term or provision of this License shall be deemed waived and no
- breach consented to unless such waiver or consent shall be in writing
- and signed by the party to be charged with such waiver or consent.
- e. This License constitutes the entire agreement between the parties with
- respect to the Work licensed here. There are no understandings,
- agreements or representations with respect to the Work not specified
- here. Licensor shall not be bound by any additional provisions that
- may appear in any communication from You. This License may not be
- modified without the mutual written agreement of the Licensor and You.
- f. The rights granted under, and the subject matter referenced, in this
- License were drafted utilizing the terminology of the Berne Convention
- for the Protection of Literary and Artistic Works (as amended on
- September 28, 1979), the Rome Convention of 1961, the WIPO Copyright
- Treaty of 1996, the WIPO Performances and Phonograms Treaty of 1996
- and the Universal Copyright Convention (as revised on July 24, 1971).
- These rights and subject matter take effect in the relevant
- jurisdiction in which the License terms are sought to be enforced
- according to the corresponding provisions of the implementation of
- those treaty provisions in the applicable national law. If the
- standard suite of rights granted under applicable copyright law
- includes additional rights not granted under this License, such
- additional rights are deemed to be included in the License; this
- License is not intended to restrict the license of any rights under
- applicable law.
- Creative Commons Notice
- Creative Commons is not a party to this License, and makes no warranty
- whatsoever in connection with the Work. Creative Commons will not be
- liable to You or any party on any legal theory for any damages
- whatsoever, including without limitation any general, special,
- incidental or consequential damages arising in connection to this
- license. Notwithstanding the foregoing two (2) sentences, if Creative
- Commons has expressly identified itself as the Licensor hereunder, it
- shall have all rights and obligations of Licensor.
- Except for the limited purpose of indicating to the public that the
- Work is licensed under the CCPL, Creative Commons does not authorize
- the use by either party of the trademark "Creative Commons" or any
- related trademark or logo of Creative Commons without the prior
- written consent of Creative Commons. Any permitted use will be in
- compliance with Creative Commons' then-current trademark usage
- guidelines, as may be published on its website or otherwise made
- available upon request from time to time. For the avoidance of doubt,
- this trademark restriction does not form part of this License.
- Creative Commons may be contacted at http://creativecommons.org/.

## Library data of the parts
C1-C7 C9 C12 C25 CF1 CS1 MC1-MC12 = rcl:C-EU: CAPACITOR, European symbol
CD1-CD12 = diode:DIODE-: DIODE
D1-D3 = bms-hsrm:RS07J
D4 = diode:ZENER-DIODE: Z-Diode
GR1-GR12 MR1-MR12 R1-R27 RF1 RF2 = rcl:R-EU_: RESISTOR, European symbol
IC1 = bms-hsrm:LTC6803-3
IC2 = bms-hsrm:LT1782
IC3 = bms-hsrm:LT6004
IC4 = bms-hsrm:4052: Dual 4-channel ANALOG MULTIPLEXER
LED1-LED12 = led:LED: LED OSRAM: - CHIPLED LG R971, LG N971, LY N971, LG Q971, LY Q971, LO R971, LY R971 LH N974, LH R974 LS Q976, LO Q976, LY Q976 LO Q996 - Hyper CHIPLED LW Q18S LB Q993, LB Q99A, LB R99A - SideLED LS A670, LO A670, LY A670, LG A670, LP A670 LB A673, LV A673, LT A673, LW A673 LH A674 LY A675 LS A676, LA A676, LO A676, LY A676, LW A676 LS A679, LY A679, LG A679 - Hyper Micro SIDELED® LS Y876, LA Y876, LO Y876, LY Y876 LT Y87S - SmartLED LW L88C, LW L88S LB L89C, LB L89S, LG L890 LS L89K, LO L89K, LY L89K LS L896, LA L896, LO L896, LY L896 - TOPLED LS T670, LO T670, LY T670, LG T670, LP T670 LSG T670, LSP T670, LSY T670, LOP T670, LYG T670 LG T671, LOG T671, LSG T671 LB T673, LV T673, LT T673, LW T673 LH T674 LS T676, LA T676, LO T676, LY T676, LB T676, LH T676, LSB T676, LW T676 LB T67C, LV T67C, LT T67C, LS T67K, LO T67K, LY T67K, LW E67C LS E67B, LA E67B, LO E67B, LY E67B, LB E67C, LV E67C, LT E67C LW T67C LS T679, LY T679, LG T679 LS T770, LO T770, LY T770, LG T770, LP T770 LB T773, LV T773, LT T773, LW T773 LH T774 LS E675, LA E675, LY E675, LS T675 LS T776, LA T776, LO T776, LY T776, LB T776 LHGB T686 LT T68C, LB T68C - Hyper Mini TOPLED® LB M676 - Mini TOPLED Santana® LG M470 LS M47K, LO M47K, LY M47K Source: http://www.osram.convergy.de LUXEON: - LUMILED® LXK2-PW12-R00, LXK2-PW12-S00, LXK2-PW14-U00, LXK2-PW14-V00 LXK2-PM12-R00, LXK2-PM12-S00, LXK2-PM14-U00 LXK2-PE12-Q00, LXK2-PE12-R00, LXK2-PE12-S00, LXK2-PE14-T00, LXK2-PE14-U00 LXK2-PB12-K00, LXK2-PB12-L00, LXK2-PB12-M00, LXK2-PB14-N00, LXK2-PB14-P00, LXK2-PB14-Q00 LXK2-PR12-L00, LXK2-PR12-M00, LXK2-PR14-Q00, LXK2-PR14-R00 LXK2-PD12-Q00, LXK2-PD12-R00, LXK2-PD12-S00 LXK2-PH12-R00, LXK2-PH12-S00 LXK2-PL12-P00, LXK2-PL12-Q00, LXK2-PL12-R00 Source: www.luxeon.com KINGBRIGHT: KA-3528ASYC Source: www.kingbright.com
QB1-QB12 = transistor-power:FDN360P: Single P-Channel, PowerTrench (R) MOSFET Source: http://www.fairchildsemi.com/ds/FD/FDN360P.pdf
REF1-REF3 = SmartPrj:FIDUCIALMOUNT
RP1-RP12 = bms-hsrm:R-EU_: RESISTOR, European symbol
SJ1 SJ2 = jumper:SJ2W: SMD solder JUMPER
X1 X2 = con-molex-micro-fit-3_0:HEADER_POS3_?: Molex - Micro-Fit 3.0 Series connector, 3.00mm (0.118") pitch header, 3 positions.
X3 = con-molex-micro-fit-3_0:HEADER_POS2_?: Molex - Micro-Fit 3.0 Series connector, 3.00mm (0.118") pitch header, 2 positions.
X4 = con-molex-micro-fit-3_0:HEADER_POS12_?: Molex - Micro-Fit 3.0 Series connector, 3.00mm (0.118") pitch header, 12 positions.
X5 = con-molex-micro-fit-3_0:HEADER_POS14_?: Molex - Micro-Fit 3.0 Series connector, 3.00mm (0.118") pitch header, 14 positions.